# Altium schematic sheet dtb-222-relays.SchDoc
size 381 x 241 mm; SheetNumber: 1; SheetTotal: 3
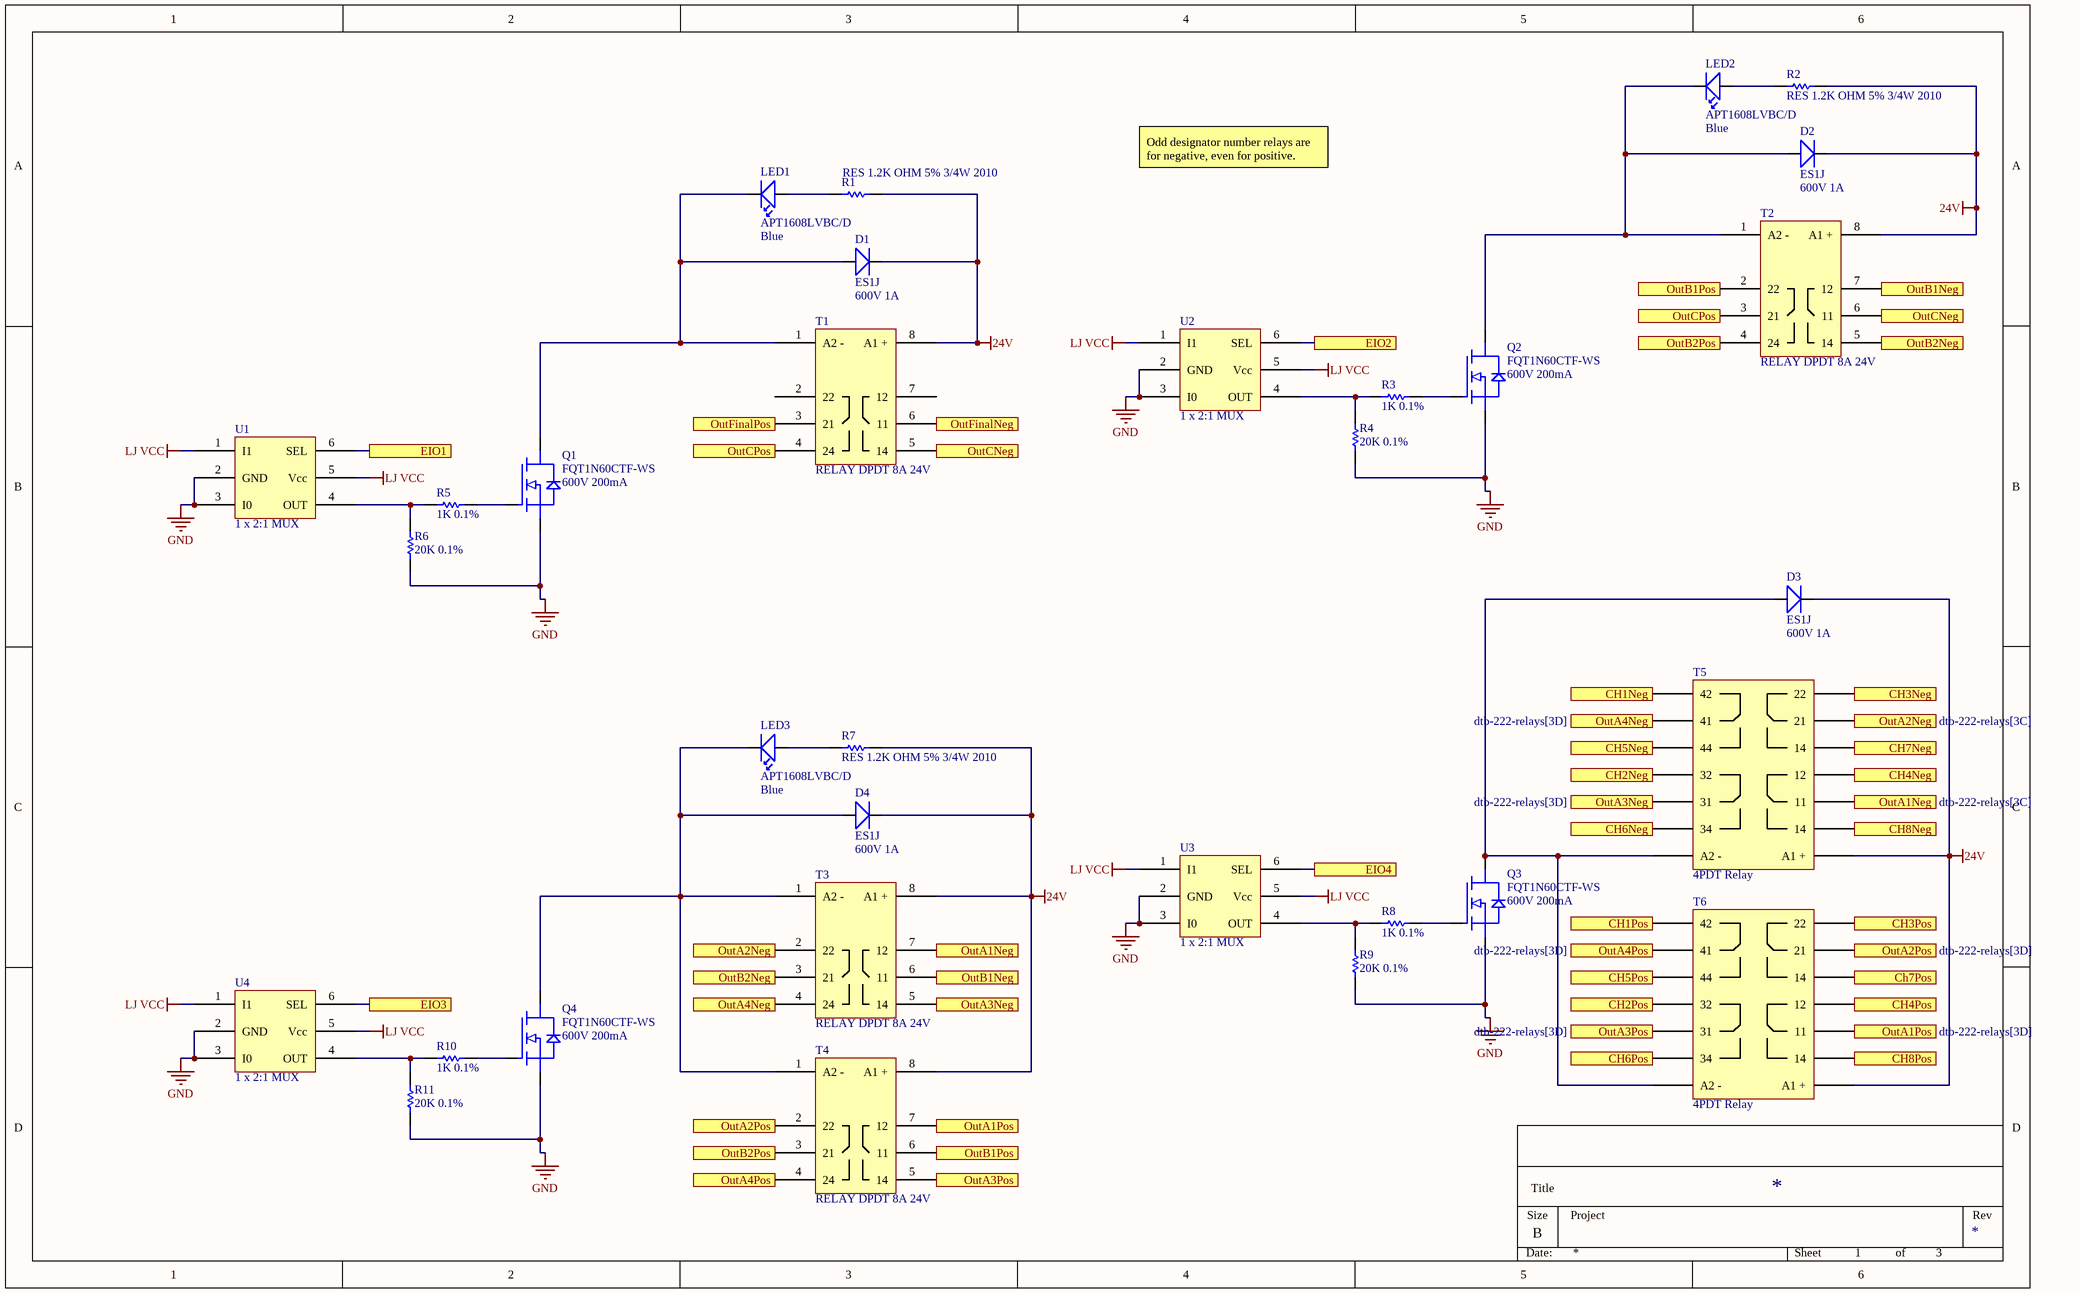
[diagram p0: dtb-222-relays.SchDoc]

## Parts
?  (no value)  (graphical)
D1  ES1J  value 600V 1A  [ES1J]
D2  ES1J  value 600V 1A  [ES1J]
D3  ES1J  value 600V 1A  [ES1J]
D4  ES1J  value 600V 1A  [ES1J]
LED1  APT1608LVBC/D  value Blue  [Standard VoltServer 0603 Kingbright HELI2 LED Footprint]
LED2  APT1608LVBC/D  value Blue  [Standard VoltServer 0603 Kingbright HELI2 LED Footprint]
LED3  APT1608LVBC/D  value Blue  [Standard VoltServer 0603 Kingbright HELI2 LED Footprint]
Q1  FQT1N60CTF-WS  value 600V 200mA  [FQT1N60CTF_WS]
Q2  FQT1N60CTF-WS  value 600V 200mA  [FQT1N60CTF_WS]
Q3  FQT1N60CTF-WS  value 600V 200mA  [FQT1N60CTF_WS]
Q4  FQT1N60CTF-WS  value 600V 200mA  [FQT1N60CTF_WS]
R1  RES 1.2K OHM 5% 3/4W 2010  [2010 Resistor]
R2  RES 1.2K OHM 5% 3/4W 2010  [2010 Resistor]
R3  value 1K 0.1%  [Standard VoltServer 0603 Resistor Footprint]  (hidden comment: ERA-3AEB102V)
R4  value 20K 0.1%  [Standard VoltServer 0603 Resistor Footprint]  (hidden comment: ERA-3AEB203V)
R5  value 1K 0.1%  [Standard VoltServer 0603 Resistor Footprint]  (hidden comment: ERA-3AEB102V)
R6  value 20K 0.1%  [Standard VoltServer 0603 Resistor Footprint]  (hidden comment: ERA-3AEB203V)
R7  RES 1.2K OHM 5% 3/4W 2010  [2010 Resistor]
R8  value 1K 0.1%  [Standard VoltServer 0603 Resistor Footprint]  (hidden comment: ERA-3AEB102V)
R9  value 20K 0.1%  [Standard VoltServer 0603 Resistor Footprint]  (hidden comment: ERA-3AEB203V)
R10  value 1K 0.1%  [Standard VoltServer 0603 Resistor Footprint]  (hidden comment: ERA-3AEB102V)
R11  value 20K 0.1%  [Standard VoltServer 0603 Resistor Footprint]  (hidden comment: ERA-3AEB203V)
T1  RELAY DPDT 8A 24V  [2961435]
T2  RELAY DPDT 8A 24V  [2961435]
T3  RELAY DPDT 8A 24V  [2961435]
T4  RELAY DPDT 8A 24V  [2961435]
T5  4PDT Relay  [2903677]
T6  4PDT Relay  [2903677]
U1  1 x 2:1 MUX  [74LVC1G157GV,125]
U2  1 x 2:1 MUX  [74LVC1G157GV,125]
U3  1 x 2:1 MUX  [74LVC1G157GV,125]
U4  1 x 2:1 MUX  [74LVC1G157GV,125]

## Ports
CH1Neg (see dtb-222-connectors[3A]), CH1Pos (see dtb-222-connectors[3A]), CH2Neg (see dtb-222-connectors[3A]), CH2Pos (see dtb-222-connectors[3A]), CH3Neg (see dtb-222-connectors[3A]), CH3Pos (see dtb-222-connectors[3A]), CH4Neg (see dtb-222-connectors[3A]), CH4Pos (see dtb-222-connectors[3A]), CH5Neg (see dtb-222-connectors[3A]), CH5Pos (see dtb-222-connectors[3A]), CH6Neg (see dtb-222-connectors[3B]), CH6Pos (see dtb-222-connectors[3A]), CH7Neg (see dtb-222-connectors[3A]), Ch7Pos (see dtb-222-connectors[3B]), CH8Neg (see dtb-222-connectors[3A]), CH8Pos (see dtb-222-connectors[3A]), EIO1 (see dtb-222-connectors[2A]), EIO2 (see dtb-222-connectors[1A]), EIO3 (see dtb-222-connectors[2A]), EIO4 (see dtb-222-connectors[1A]), OutA1Neg (see dtb-222-relays[3C]), OutA1Neg (see dtb-222-relays[6C]), OutA1Pos (see dtb-222-relays[3D]), OutA1Pos (see dtb-222-relays[6D]), OutA2Neg (see dtb-222-relays[3C]), OutA2Neg (see dtb-222-relays[6C]), OutA2Pos (see dtb-222-relays[3D]), OutA2Pos (see dtb-222-relays[6C]), OutA3Neg (see dtb-222-relays[3D]), OutA3Neg (see dtb-222-relays[5C]), OutA3Pos (see dtb-222-relays[3D]), OutA3Pos (see dtb-222-relays[5D]), OutA4Neg (see dtb-222-relays[3D]), OutA4Neg (see dtb-222-relays[5C]), OutA4Pos (see dtb-222-relays[3D]), OutA4Pos (see dtb-222-relays[5C]), OutB1Neg (see dtb-222-relays[3D]), OutB1Neg (see dtb-222-relays[6A]), OutB1Pos (see dtb-222-relays[3D]), OutB1Pos (see dtb-222-relays[5A]), OutB2Neg (see dtb-222-relays[3D]), OutB2Neg (see dtb-222-relays[6B]), OutB2Pos (see dtb-222-relays[3D]), OutB2Pos (see dtb-222-relays[5B]), OutCNeg (see dtb-222-relays[3B]), OutCNeg (see dtb-222-relays[6A]), OutCPos (see dtb-222-relays[3B]), OutCPos (see dtb-222-relays[5A]), OutFinalNeg (see dtb-222-connectors[3B]), OutFinalPos (see dtb-222-connectors[3B])

## Nets
24V: D1.1 D2.1 D3.1 D4.1 R1.2 R2.2 R7.2 T1.8(A1_+) T2.8(A1_+) T3.8(A1_+) T4.8(A1_+) T5.1(A1_+) T6.1(A1_+)
GND: Q1.3(S) Q2.3(S) Q3.3(S) Q4.3(S) R4.1 R6.1 R9.1 R11.1 U1.2(GND) U1.3(I0) U2.2(GND) U2.3(I0) U3.2(GND) U3.3(I0) U4.2(GND) U4.3(I0)
LJ VCC: U1.1(I1) U1.5(Vcc) U2.1(I1) U2.5(Vcc) U3.1(I1) U3.5(Vcc) U4.1(I1) U4.5(Vcc)
CH1Neg: T5.14(42) ; port CH1Neg
CH1Pos: T6.14(42) ; port CH1Pos
CH2Neg: T5.13(32) ; port CH2Neg
CH2Pos: T6.13(32) ; port CH2Pos
CH3Neg: T5.12(22) ; port CH3Neg
CH3Pos: T6.12(22) ; port CH3Pos
CH4Neg: T5.11(12) ; port CH4Neg
CH4Pos: T6.11(12) ; port CH4Pos
CH5Neg: T5.10(44) ; port CH5Neg
CH5Pos: T6.10(44) ; port CH5Pos
CH6Neg: T5.9(34) ; port CH6Neg
CH6Pos: T6.9(34) ; port CH6Pos
CH7Neg: T5.8(14) ; port CH7Neg
Ch7Pos: T6.8(14) ; port Ch7Pos
CH8Neg: T5.7(14) ; port CH8Neg
CH8Pos: T6.7(14) ; port CH8Pos
EIO1: U1.6(SEL) ; port EIO1
EIO2: U2.6(SEL) ; port EIO2
EIO3: U4.6(SEL) ; port EIO3
EIO4: U3.6(SEL) ; port EIO4
OutA1Neg: T3.7(12) T5.3(11) ; port OutA1Neg
OutA1Pos: T4.7(12) T6.3(11) ; port OutA1Pos
OutA2Neg: T3.2(22) T5.4(21) ; port OutA2Neg
OutA2Pos: T4.2(22) T6.4(21) ; port OutA2Pos
OutA3Neg: T3.5(14) T5.5(31) ; port OutA3Neg
OutA3Pos: T4.5(14) T6.5(31) ; port OutA3Pos
OutA4Neg: T3.4(24) T5.6(41) ; port OutA4Neg
OutA4Pos: T4.4(24) T6.6(41) ; port OutA4Pos
OutB1Neg: T2.7(12) T3.6(11) ; port OutB1Neg
OutB1Pos: T2.2(22) T4.6(11) ; port OutB1Pos
OutB2Neg: T2.5(14) T3.3(21) ; port OutB2Neg
OutB2Pos: T2.4(24) T4.3(21) ; port OutB2Pos
OutCNeg: T1.5(14) T2.6(11) ; port OutCNeg
OutCPos: T1.4(24) T2.3(21) ; port OutCPos
OutFinalNeg: T1.6(11) ; port OutFinalNeg
OutFinalPos: T1.3(21) ; port OutFinalPos
NetD1_2: D1.2 LED1.2 Q1.4(D) T1.1(A2_-)
NetD2_2: D2.2 LED2.2 Q2.4(D) T2.1(A2_-)
NetD3_2: D3.2 Q3.4(D) T5.2(A2_-) T6.2(A2_-)
NetD4_2: D4.2 LED3.2 Q4.4(D) T3.1(A2_-) T4.1(A2_-)
NetLED1_1: LED1.1 R1.1
NetLED2_1: LED2.1 R2.1
NetLED3_1: LED3.1 R7.1
NetQ1_1: Q1.1(G) R5.1
NetQ2_1: Q2.1(G) R3.1
NetQ3_1: Q3.1(G) R8.1
NetQ4_1: Q4.1(G) R10.1
NetR3_2: R3.2 R4.2 U2.4(OUT)
NetR5_2: R5.2 R6.2 U1.4(OUT)
NetR8_2: R8.2 R9.2 U3.4(OUT)
NetR10_2: R10.2 R11.2 U4.4(OUT)

Not connected (* = marked no-connect by the designer): T1 2(22) 7(12)

## Notes on the sheet
- Odd designator number relays are for negative, even for positive.
- Size
- Title
- B
- Project
- Rev
- Date:
- Sheet
- of

## Library data of the parts
? = VoltServer Title Block
D1-D4 = ES1J: DIODE 1A 600V 35nS SMA; Manufacturer: Fairchild; Vendor PN: ES1JFSCT-ND; Vendor: Digikey; Manufacturer PN: ES1J
LED1-LED3 = APT1608LVBC/D: Blue 470nm LED Indication - Discrete 2.65V 0603 (1608 Metric); Manufacturer: Kingbright; Vendor: Digikey; Vendor PN: 754-1933-1-ND; Manufacturer PN: APT1608LVBC/D
Q1-Q4 = FQT1N60CTF-WS: MOSFET N-CH 600V 200MA SOT-223-4; Manufacturer: Fairchild Semiconductor; Vendor: Digikey; Vendor PN: FQT1N60CTF-WSCT-ND; Manufacturer PN: FQT1N60CTF-WS
R1 R2 R7 = RMCF2010JT1K20: 1.2 kOhms ±5% 0.75W, 3/4W Chip Resistor 2010 (5025 Metric) Automotive AEC-Q200 Thick Film; Manufacturer: Stackpole Electionics Inc; Value: 1.2 kOhm, +/- 5%, 0.75W; Vendor: Digi-Key; Vendor PN: RMCF2010JT1K20CT-ND; Manufacturer PN: RMCF2010JT1K20
R3 R5 R8 R10 = ERA-3AEB102V: RES SMD 1K OHM 0.1% 1/10W 0603; Manufacturer: Panasonic; Vendor: Digikey; Vendor PN: P1.0KDBCT-ND; Manufacturer PN: ERA-3AEB102V
R4 R6 R9 R11 = ERA-3AEB203V: RES SMD 20K OHM 0.1% 1/10W 0603; Manufacturer: Panasonic; Vendor: Digikey; Vendor PN: P20KDBCT-ND; Manufacturer PN: ERA-3AEB203V
T1-T4 = 2961435 with R95-132: Relay 2961435 with R95-132 socket for pcb mounting; Manufacturer: Phoenix Contact; NTE Electronics Inc; Manufacturer PN: 2961435; R95-132; Vendor: Digi-Key; Vendor PN: 277-5185-ND; 2368-R95-132-ND; Value: DPDT Relay
T5 T6 = 2903677 with PY14-02: General Purpose Relay 4PDT (4 Form C) 24VDC Coil Socketable with Socket; Manufacturer: Phoenix Contact; Omron Automation and Safety; Manufacturer PN: 2903677; PY14-02; Vendor: Digi-Key; Vendor PN: 277-11902-ND; Z813-ND; Value: 4PDT Relay with Socket
U1-U4 = 74LVC1G157GV,125: Multiplexer 1 x 2:1 6-TSOP; Manufacturer: Nexperia USA Inc.; Vendor: Digi-Key; Vendor PN: 1727-3490-1-ND; Value: 1 x 2:1 MUX; Manufacturer PN: 74LVC1G157GV,125